# EAGLE design accuphase_e202_rectifier-caps_on_pins (EAGLE 7.3.0)
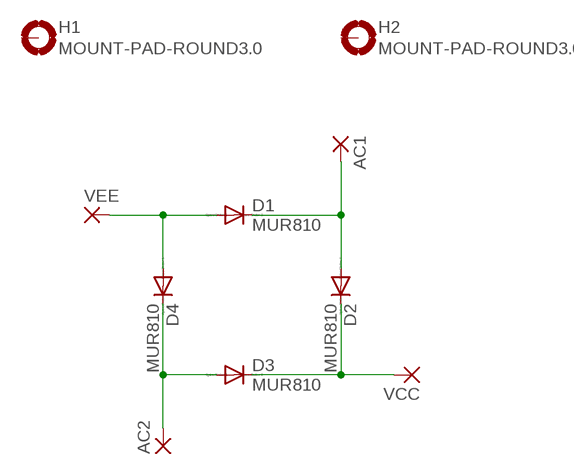
[diagram p0: schematic, sheet 1]

## Parts
AC1  3,81/1,4  [3,81/1,4]
AC2  3,81/1,4  [3,81/1,4]
D1  MUR810  [TO220ACS]
D2  MUR810  [TO220ACS]
D3  MUR810  [TO220ACS]
D4  MUR810  [TO220ACS]
H1  MOUNT-PAD-ROUND3.0  [3,0-PAD]
H2  MOUNT-PAD-ROUND3.0  [3,0-PAD]
VCC  3,81/1,4  [3,81/1,4]
VEE  3,81/1,4  [3,81/1,4]

## Nets
N$1: AC1.1(P) D1.C D2.A
N$2: D2.C D3.C VCC.1(P)
N$3: AC2.1(P) D3.A D4.C
N$4: D1.A D4.A VEE.1(P)
Unconnected: H1.B3,0(MOUNT) H2.B3,0(MOUNT)

## Library data of the parts
AC1 AC2 VCC VEE = wirepad:3,81/1,4: THROUGH-HOLE PAD
D1-D4 = diode:MUR810: DIODE
H1 H2 = holes:MOUNT-PAD-ROUND: MOUNTING PAD, round

## Board
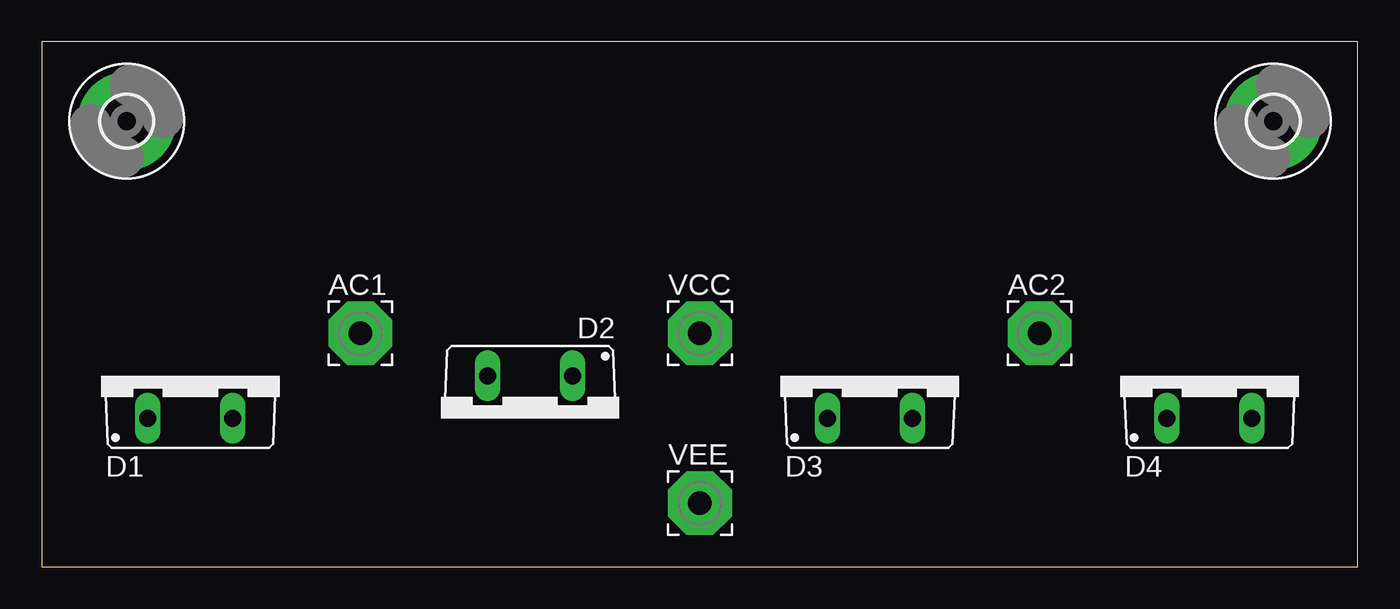
[diagram p1: board, top side]
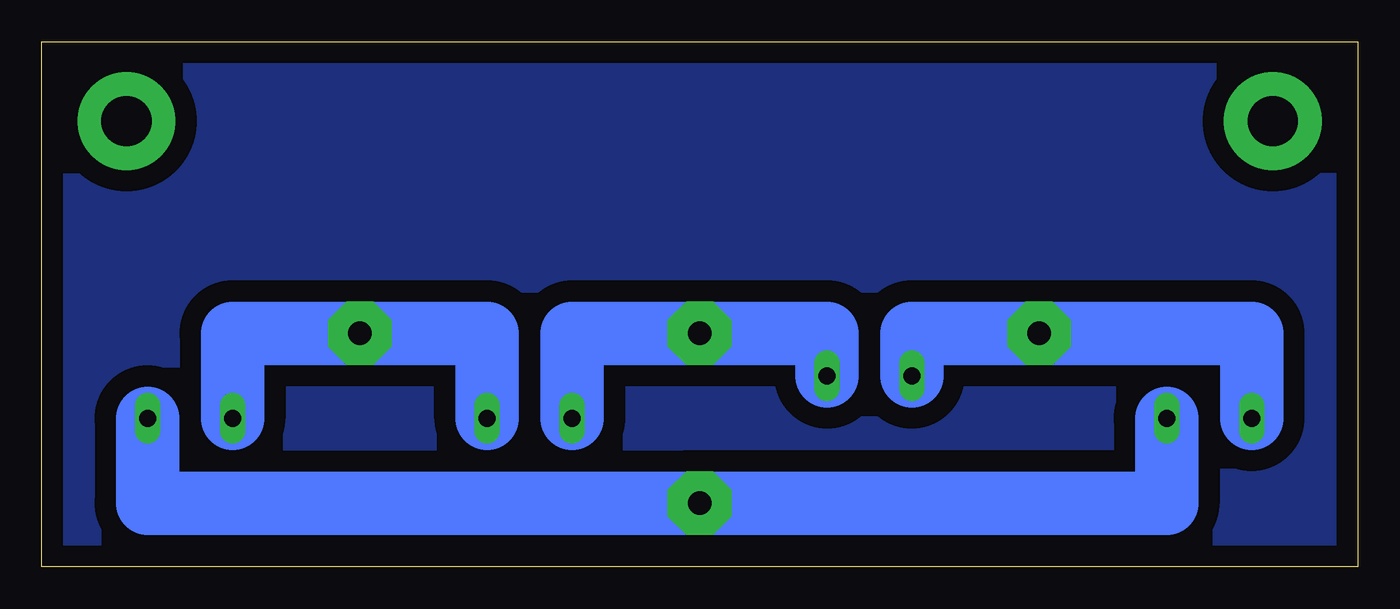
[diagram p2: board, bottom side, seen from below]

Size 78.72 x 31.42 mm. Coordinates in mm from the lower left corner, seen from the top.
Outline: 0,0 78.72,0 78.72,31.42 0,31.42 0,0
Copper layers (1*16): Top 0.035mm / dielectric 1.5mm / Bottom 0.035mm
Design rules "default": minimum track width 10mil, minimum drill 24mil, track to track 8mil, track to pad 8mil, pad to pad 8mil, via to via 8mil, smd to smd 8mil, copper to edge 40mil, drill to drill 8mil, minimum pad ring 10mil, minimum via ring 8mil, stop-mask expansion 4mil, vias tented up to drill 0mil, thermal gap 10mil

### Footprints (pad centres in the part's own frame; a part is rotated, then mirrored left to right if it is on the bottom)
3,81/1,4 = drill 1.397 pad 3.81 octagon: 1 0,0
TO220ACS = drill 1.016 long: A 2.54,-2.54; C -2.54,-2.54
3,0-PAD = drill 3 pad 5.842: B3,0 0,0

### Placement (x,y rotation side)
AC1  19.05,13.97 0 top
AC2  59.69,13.97 0 top
D1  8.89,11.43 0 top
D2  29.21,8.89 180 top
D3  49.53,11.43 0 top
D4  69.85,11.43 0 top
H1  73.66,26.67 0 top
H2  5.08,26.67 0 top
VCC  39.37,13.97 0 top
VEE  39.37,3.81 0 top

### Tracks (layer width: path | path; a pad name or v marks a point on that pad's centre or on a via)
N$1
  Bottom 3.81: D1.C 6.35,13.97 AC1.1 26.67,13.97 D2.A
N$2
  Bottom 3.81: D2.C 31.75,13.97 VCC.1 46.99,13.97 D3.C
N$3
  Bottom 3.81: D3.A 52.07,13.97 AC2.1 67.31,13.97 D4.C
N$4
  Bottom 3.81: D1.A 11.43,3.81 VEE.1 72.39,3.81 D4.A
N$5
  pour Bottom (isolate 1.27): 0,0 0,31.75 78.74,31.75 78.74,0